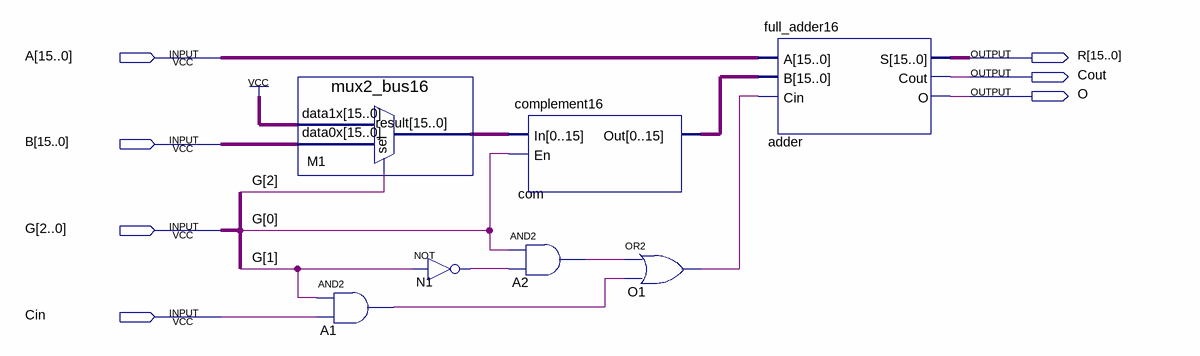
[diagram p0: schematic sheet]
// Quartus schematic arithmetic_unit.bdf as structural Verilog: 7 symbols, 7 pins
module arithmetic_unit (
  input  [15:0] A,
  input  [15:0] B,
  input  [2:0] G,
  input  Cin,
  output [15:0] R,
  output Cout,
  output O
);

  wire A1_out, A2_out, N1_out, O1_out;
  wire [15:0] com_out, M1_result;

  mux2_bus16 M1 (.data1x({16{1'b1}}), .data0x(B), .sel(G[2]), .result(M1_result));
  and A1 (A1_out, G[1], Cin);
  not N1 (N1_out, G[1]);
  complement16 com (.In(M1_result), .En(G[0]), .Out(com_out));
  and A2 (A2_out, G[0], N1_out);
  or O1 (O1_out, A2_out, A1_out);
  full_adder16 adder (.A(A), .B(com_out), .Cin(O1_out), .S(R), .Cout(Cout), .O(O));
endmodule
